# Altium schematic sheet Sheet1.SchDoc
size A4; SheetNumber: 1; SheetTotal: 1; SPICEModelCachePZLPLTVJ: <root> / <DocumentId>PZLPLTVJ</DocumentId> / </root>
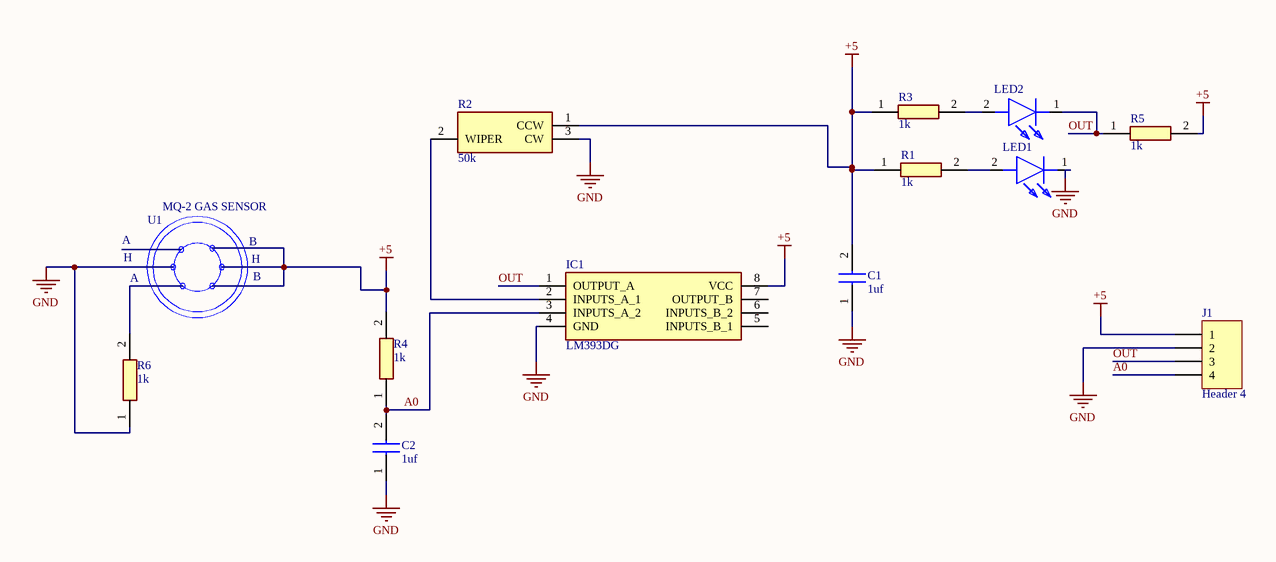
[diagram p0: Sheet1.SchDoc]

## Parts
C1  1uf  [CAPC2012X145N]
C2  1uf  [CAPC2012X145N]
IC1  LM393DG  [SOIC127P600X175-8N]
J1  Header 4  [HDR1X4]
LED1  151031VS06000  [151034GS03000]  (value not drawn)
LED2  151031VS06000  [151034GS03000]  (value not drawn)
R1  1k  [RESC2012X60N]
R2  50k  [3386P_1]
R3  1k  [RESC2012X60N]
R4  1k  [RESC2012X60N]
R5  1k  [RESC2012X60N]
R6  1k  [RESC2012X60N]
U1  MQ-2 GAS SENSOR  [configuration]

## Nets
+5: C1.2 IC1.8(VCC) J1.1 R1.1 R2.1(CCW) R3.1 R4.2 R5.2
GND: C1.1 C2.1 IC1.4(GND) J1.2 LED1.1(K) R2.3(CW) R6.1
A0: C2.2 IC1.3(INPUTS_A_2) J1.4 R4.1
OUT: IC1.1(OUTPUT_A) J1.3 LED2.1(K) R5.1
NetIC1_2: IC1.2(INPUTS_A_1) R2.2(WIPER)
NetLED1_2: LED1.2(A) R1.2
NetLED2_2: LED2.2(A) R3.2

Not connected (* = marked no-connect by the designer): IC1 5(INPUTS_B_1) 6(INPUTS_B_2) 7(OUTPUT_B); R6 2

## Notes on the sheet
- A
- B
- H

## Library data of the parts
C1 C2 = GRM21BR71H105KA12L: Capacitor; Manufacturer_Name: Murata Electronics; Datasheet Link: http://www.murata.com/~/media/webrenewal/support/library/catalog/products/capacitor/mlcc/c02e.pdf; Height: 1.45mm; Manufacturer_Part_Number: GRM21BR71H105KA12L; Mouser Part Number: 81-GRM21BR71H105KA2L; Mouser Price/Stock: https://www.mouser.co.uk/ProductDetail/Murata-Electronics/GRM21BR71H105KA12L?qs=Er06SXQpt%252B60EIT%2FJ7%2F41Q%3D%3D; Arrow Part Number: GRM21BR71H105KA12L; Arrow Price/Stock: https://www.arrow.com/en/products/grm21br71h105ka12l/murata-manufacturing?region=europe
IC1 = LM393DG: Integrated Circuit; Manufacturer_Name: onsemi; Datasheet Link: https://www.onsemi.com/pub/Collateral/LM393-D.PDF; Height: 1.75mm; Manufacturer_Part_Number: LM393DG; Mouser Part Number: 863-LM393DG; Mouser Price/Stock: https://www.mouser.co.uk/ProductDetail/onsemi/LM393DG?qs=2OtswVQKCOHzXsheSqC0ow%3D%3D; Arrow Part Number: LM393DG; Arrow Price/Stock: https://www.arrow.com/en/products/lm393dg/on-semiconductor?region=nac
J1 = Header 4: Header, 4-Pin; LatestRevisionDate: 17-Jul-2002; LatestRevisionNote: Re-released for DXP Platform.; Publisher: Altium Limited
LED1 LED2 = 151031VS06000: LED; Manufacturer_Name: Wurth Elektronik; Datasheet Link: https://katalog.we-online.de/led/datasheet/151031VS06000.pdf; Manufacturer_Part_Number: 151031VS06000; Mouser Part Number: 710-151031VS06000; Mouser Price/Stock: https://www.mouser.co.uk/ProductDetail/Wurth-Elektronik/151031VS06000?qs=LlUlMxKIyB01ggED1iKswA%3D%3D
R1 R3-R6 = RC0805FR-071KL: Resistor; Manufacturer_Name: KEMET; Datasheet Link: http://www.yageo.com/documents/recent/PYu-RC_Group_51_RoHS_L_10.pdf; Height: 0.6mm; Manufacturer_Part_Number: RC0805FR-071KL; Mouser Part Number: 603-RC0805FR-071KL; Mouser Price/Stock: https://www.mouser.co.uk/ProductDetail/YAGEO/RC0805FR-071KL?qs=1ogmaHw32WJjeGY0DHXakQ%3D%3D; Arrow Part Number: RC0805FR-071KL; Arrow Price/Stock: https://www.arrow.com/en/products/rc0805fr-071kl/yageo?region=nac
R2 = 3386P-1-104LF: Variable Resistor; Manufacturer_Name: Bourns; Datasheet Link: https://componentsearchengine.com/Datasheets/2/3386P-1-104LF.pdf; Manufacturer_Part_Number: 3386P-1-104LF; Mouser Part Number: 652-3386P-1-104LF; Mouser Price/Stock: https://www.mouser.co.uk/ProductDetail/Bourns/3386P-1-104LF?qs=m2uG%2FFdTAPVt57WUqvIChw%3D%3D; Arrow Part Number: 3386P-1-104LF; Arrow Price/Stock: https://www.arrow.com/en/products/3386p-1-104lf/bourns?region=nac
U1 = MQ-2: FEATURES / Wide detecting scope Fast response and High sensitivity / Stable and long life Simple drive circuit; ComponentLink1Description: data sheet; ComponentLink1URL: https://www.mouser.com/datasheet/2/321/605-00008-MQ-2-Datasheet-370464.pdf